# EasyEDA schematic StyroCut circuit diagram.json
TITLE: Full Circuit Diagram; REV: 1.0; Date: 2021-02-12; Sheet: 1/1; Company: StyroCut
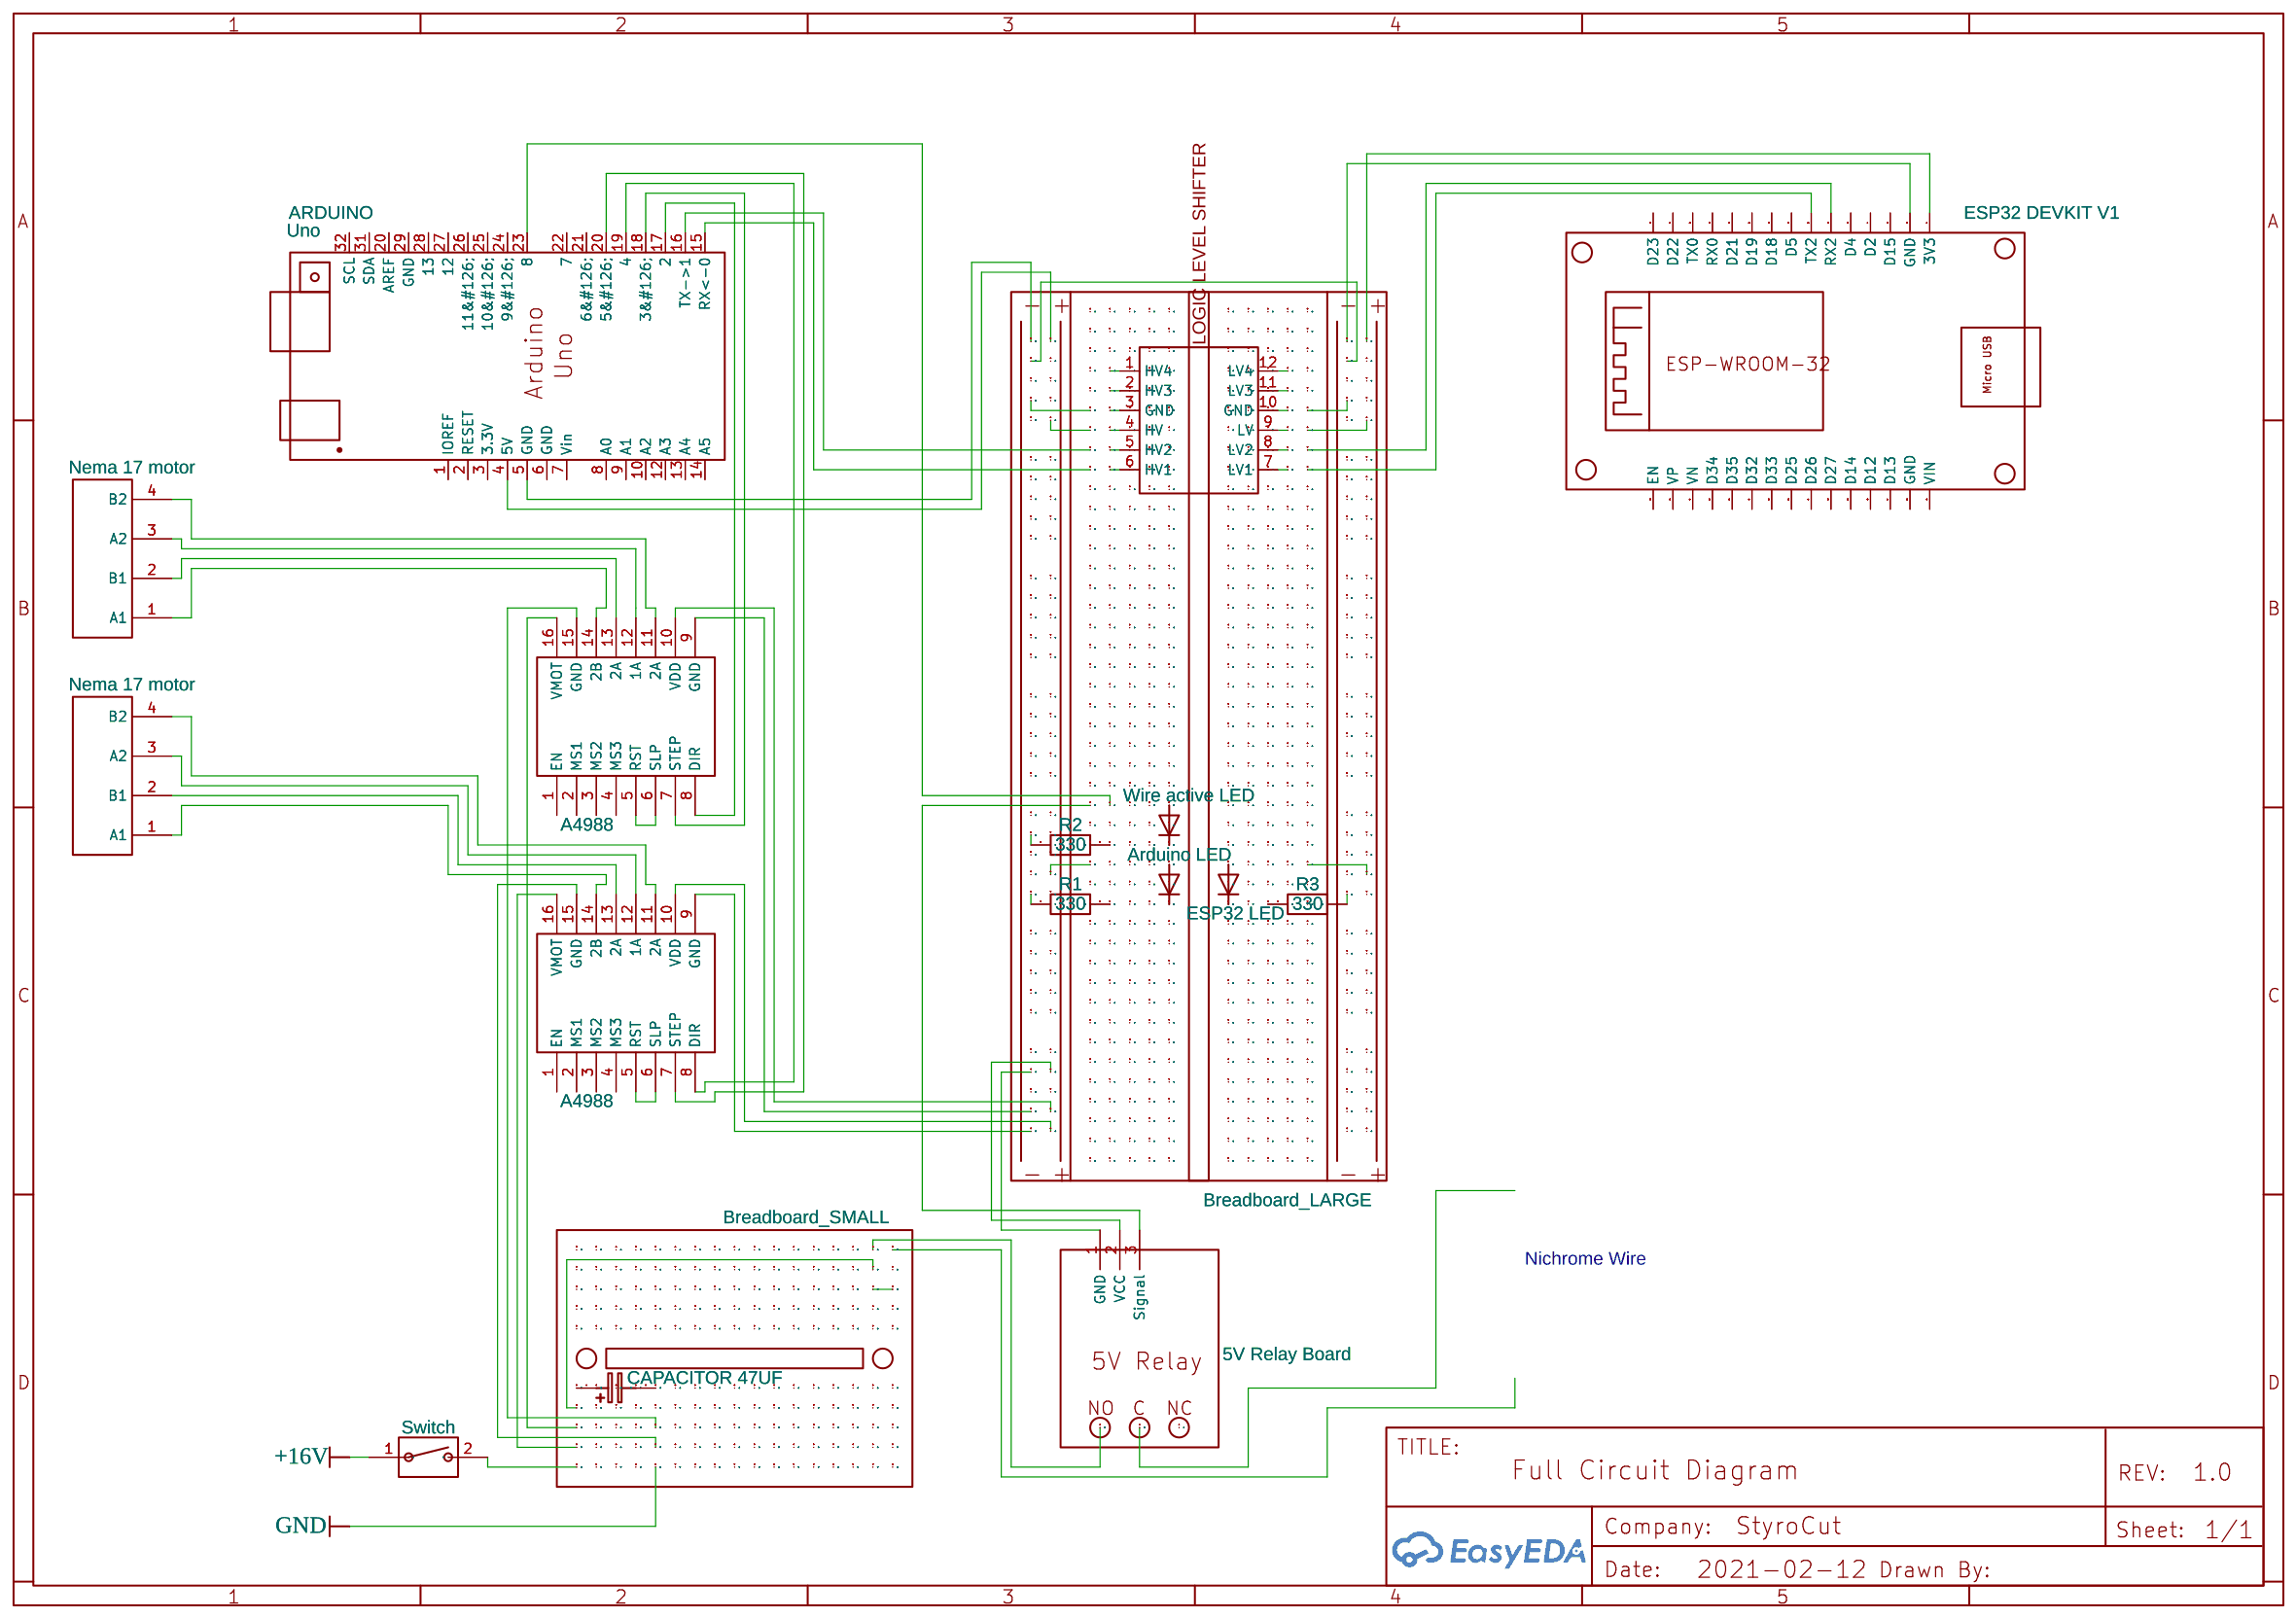
[diagram p0: schematic sheet]

## Parts
ARDUINO  Uno
M3  Nema 17 motor  [NEMA17]
M4  Nema 17 motor  [NEMA17]
R1  330  [R0603]
R2  330  [R0603]
R3  330  [R0603]
U1  Arduino LED
U2  Wire active LED
U3  ESP32 DEVKIT V1  [ESP32 DOIT DEVKIT 1]
U4  Breadboard_SMALL
U5  LOGIC LEVEL SHIFTER  [4 CHANNEL LOGIC LEVEL SHIFTER BSS138_UPIM]
U6  A4988  [A4988]
U7  A4988  [A4988]
U8  ESP32 LED
U9  CAPACITOR 47UF  [CAPACITOR 47UF]
U10  Switch  [SWITCH]
U11  5V Relay Board
U12  Breadboard_LARGE

## Library data of the parts
ARDUINO = Uno: Contributor: Ezequiel Celario Sedano
M3 M4 = Nema 17 pinout: Manufacturer Part: 1x4 male header; Contributor: GordanTrevis
R1-R3 = R_0603_EU: Contributor: LCEDA_Lib
U1 U2 U8 = Light Emitting Diode: Contributor: YasirM
U3 = ESP32 DEVKIT: Manufacturer Part: ESP32_DOIT_DEVKIT_30_PIN; Contributor: RussellV
U4 = Breadboard_SMALL: Contributor: YasirM
U5 = LOGIC LEVEL SHIFTER: Manufacturer Part: 4 channel logic level shifter bss138; Contributor: Firman Maulana Ramadhan
U6 U7 = A4988: Contributor: ninthscv
U9 = CAPACITOR 47UF: Contributor: onefour
U10 = Switch: Manufacturer Part: NE5532P; Contributor: Destora; Package Display: No
U11 = 5V_Relay_Board: Contributor: YasirM
U12 = Breadboard_LARGE: Contributor: Guest

## Nets
+16V: U10.1
GND: U4.2 U6.15(GND) U6.16(VMOT) U7.15(GND) U7.16(VMOT) U9.1 U9.2 U10.2 U11.4(1)
Net-(ARDUINO-4): ARDUINO.4(5V) ARDUINO.5(GND) ARDUINO.15(RX<-0) ARDUINO.16(TX->1) ARDUINO.23(8) R1.1 R1.2 R2.1 R2.2 R3.1 R3.2 U1.1 U1.2 U2.1 U2.2 U3.1(3V3) U3.2(GND) U3.9(RX2) U3.10(TX2) U5.1(HV4) U5.2(HV3) U5.3(GND) U5.4(HV) U5.5(HV2) U5.6(HV1) U5.7(LV1) U5.8(LV2) U5.9(LV) U5.10(GND) U5.11(LV3) U5.12(LV4) U6.9(GND) U6.10(VDD) U7.9(GND) U7.10(VDD) U8.1 U8.2 U11.1(GND) U11.2(VCC) U11.3(Signal) U12.2
Net-(ARDUINO-17): ARDUINO.17(2) U6.8(DIR)
Net-(ARDUINO-18): ARDUINO.18(3&#126;) U6.7(STEP)
Net-(ARDUINO-19): ARDUINO.19(4) U7.8(DIR)
Net-(ARDUINO-20): ARDUINO.20(AREF) U7.7(STEP)
Net-(M3-1): M3.1(A1) U6.14(2B)
Net-(M3-2): M3.2(B1) U6.13(2A)
Net-(M3-3): M3.3(A2) U6.12(1A)
Net-(M3-4): M3.4(B2) U6.11(2A)
Net-(M4-1): M4.1(A1) U7.14(2B)
Net-(M4-2): M4.2(B1) U7.13(2A)
Net-(M4-3): M4.3(A2) U7.12(1A)
Net-(M4-4): M4.4(B2) U7.11(2A)
Net-(U6-5): U6.5(RST) U6.6(SLP)
Net-(U7-5): U7.5(RST) U7.6(SLP)

Not connected (* = marked no-connect by the designer): ARDUINO 1(IOREF) 2(RESET) 3(3.3V) 6(GND) 7(Vin) 8(A0) 9(A1) 10(A2) 12(A3) 13(A4) 14(A5) 21(6&#126;) 22(7) 24(9&#126;) 25(10&#126;) 26(11&#126;) 27(12) 28(13) 29(GND) 31(SDA) 32(SCL); U3 6(D15) 7(D2) 8(D4) 11(D5) 12(D18) 13(D19) 14(D21) 15(RX0) 16(TX0) 17(D22) 18(D23) 19(EN) 20(VP) 21(VN) 22(D34) 23(D35) 24(D32) 25(D33) 26(D25) 27(D26) 28(D27) 29(D14) 30(D12) 31(D13) 35(GND) 36(VIN); U6 1(EN) 2(MS1) 3(MS2) 4(MS3); U7 1(EN) 2(MS1) 3(MS2) 4(MS3)

## Notes on the sheet
- Nichrome Wire
